# Altium schematic sheet 11 SWITCH & LED.SchDoc
size 513 x 386 mm
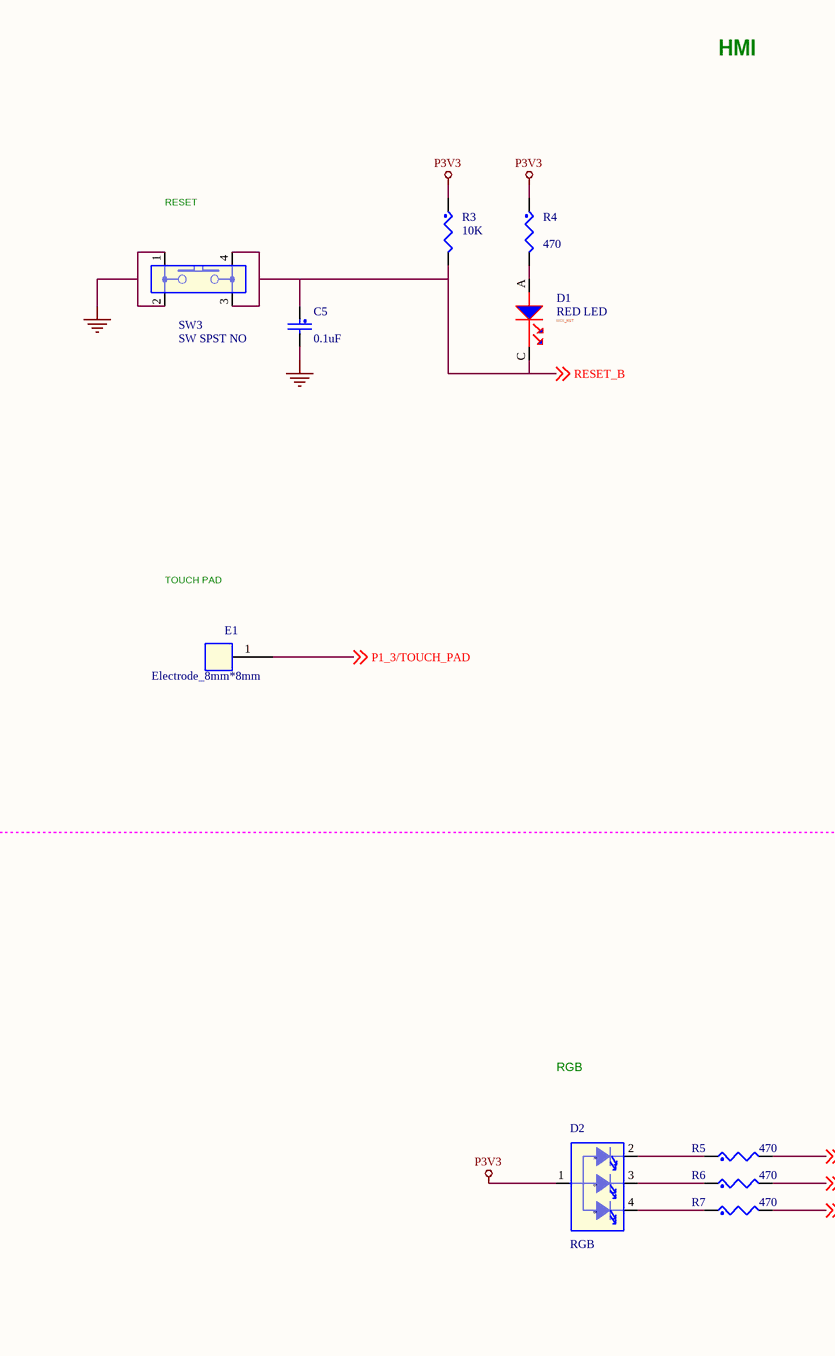
[diagram p0: 11 SWITCH & LED.SchDoc, left]
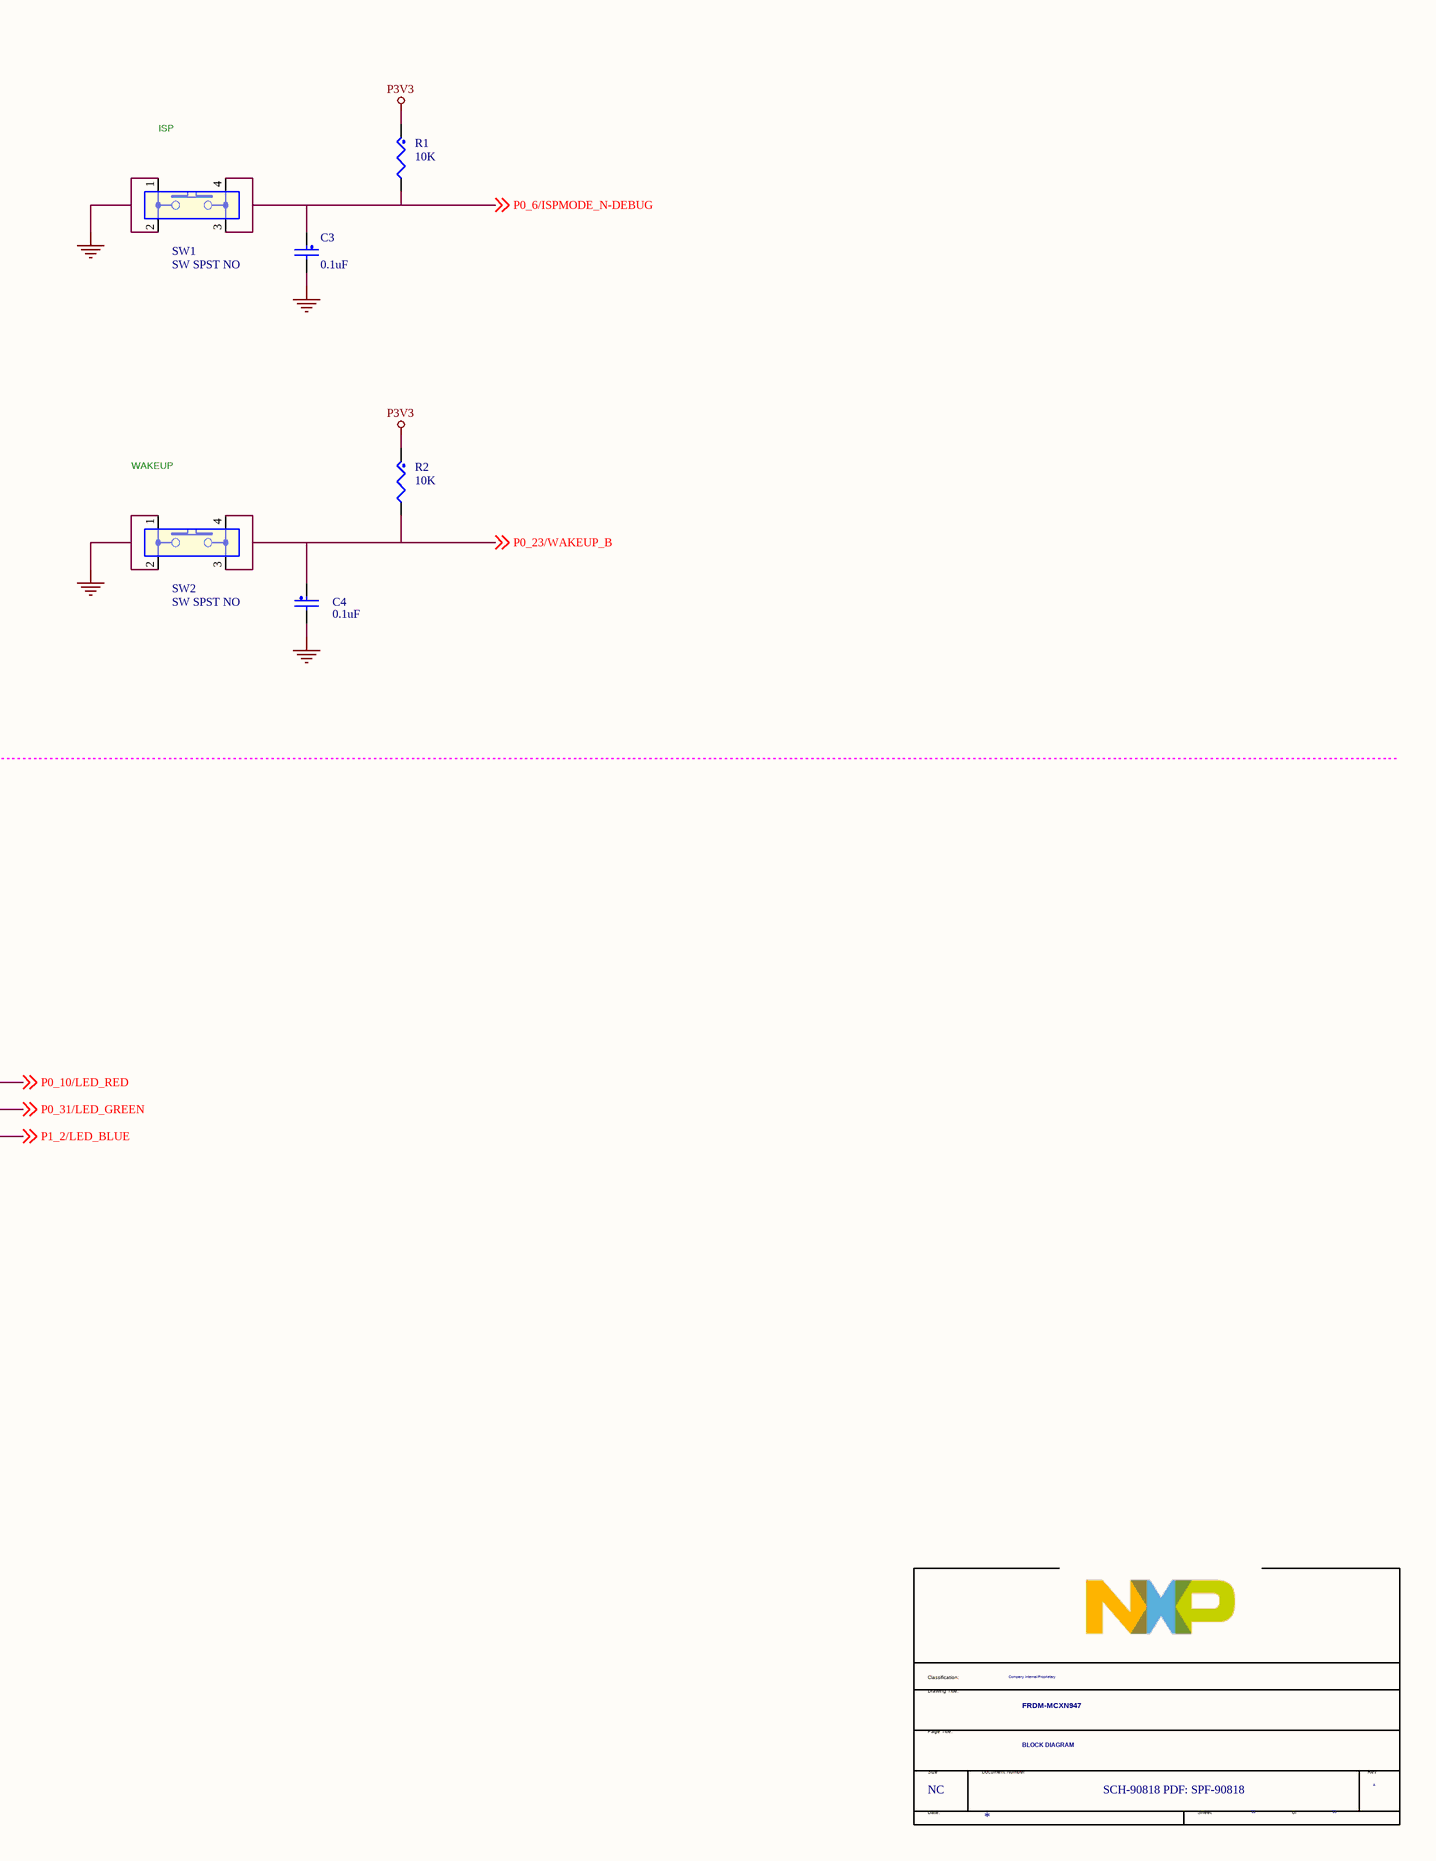
[diagram p1: 11 SWITCH & LED.SchDoc, right]

## Parts
*  Doc: SCH-90818 PDF: SPF-90818  RevCode: A  Title: FRDM-MCXN947  Page Size: NC  Page Number: 11  Page Count: 13  PageTitle: BLOCK DIAGRAM  Classification: Company Internal/Proprietary  (hidden comment: TitleBlock_FS)  (graphical)
C3  0.1uF  [CC0402_25]
C4  0.1uF  [CC0402_25]
C5  0.1uF  [CC0402_25]
D1  RED LED  SILK: MCX_RST  [led_1p1_1p1x0p6_sm]
D2  RGB  [led4_2p7x2p6_sm]
E1  Electrode_8mm*8mm  SILK: TOUCH PAD  [electrode_8mm_sq_cir]
R1  10K  [RC0402_25]
R2  10K  [RC0402_25]
R3  10K  [RC0402_25]
R4  470  [RC0402_25]
R5  470  [RC0402_25]
R6  470  [RC0402_25]
R7  470  [RC0402_25]
SW1  SW SPST NO  SILK: ISP  [sw4_4p15_4p2x3p2_sm]
SW2  SW SPST NO  SILK: WAKEUP  [sw4_4p15_4p2x3p2_sm]
SW3  SW SPST NO  SILK: RESET  [sw4_4p15_4p2x3p2_sm]

## Nets
GND: C3.2 C4.2 C5.2 SW1.1 SW1.2 SW2.1 SW2.2 SW3.1 SW3.2
P3V3: D2.1(ANODE) R1.1 R2.1 R3.1 R4.1
P0_6/ISPMODE_N-DEBUG: C3.1 R1.2 SW1.3 SW1.4 ; off-sheet P0_6/ISPMODE_N-DEBUG
P0_10/LED_RED: R5.2 ; off-sheet P0_10/LED_RED
P0_23/WAKEUP_B: C4.1 R2.2 SW2.3 SW2.4 ; off-sheet P0_23/WAKEUP_B
P0_31/LED_GREEN: R6.2 ; off-sheet P0_31/LED_GREEN
P1_2/LED_BLUE: R7.2 ; off-sheet P1_2/LED_BLUE
P1_3/TOUCH_PAD: E1.1 ; off-sheet P1_3/TOUCH_PAD
RESET_B: C5.1 D1.C(CATHODE) R3.2 SW3.3 SW3.4 ; off-sheet RESET_B
NetD1_A: D1.A(ANODE) R4.2
NetD2_2: D2.2(CATHODE1) R5.1
NetD2_3: D2.3(CATHODE2) R6.1
NetD2_4: D2.4(CATHODE3) R7.1

## Notes on the sheet
- HMI
- (in symbol LRTBR48G_4P) R; G; B
- (in symbol TitleBlock_FS) Classification:; Drawing Title:; Page Title:; Size; Document Number; Rev; Date:; Sheet; of

## Library data of the parts
* = TitleBlock_FS: Classification: Public, Company Internal/Proprietary, Company Confidential,  Company Secret; OrgName: NXP Semiconductors; OrgAddr1: 6501 William Cannon Drive West; OrgAddr2: Austin, TX 78735-8598; Variant Name: <Core Design>; Page Create Date: March  8, 1995; Page Modify Date: *
C3 = CAP_NP: CAP CER 0.1UF 16V 10% X7R 0402; CLASS: DISCRETE; Temp Range: -55C to +125C; SIGNAL_MODEL: DEFAULT_CAPACITOR_100000pF_2_1; AGILE_PN: 150-75182; MFG_NAME01: Samsung Electro-Mechanics; MFG_PN01: CL05B104KO5NNNC; CAD_APPROVED: Yes; FPLIST: CC0402_25,CC0402_HD,0402_CC,CAPC0402_L,cc0402_lamp3; Temp_Range: -55°C to +85°C; PCB Footprint: CC0402_25; 3D_Mechanical_Footprint_File: http://fcl.am.freescale.net/ALLEGRO/step/cc0402_25.STEP; Rated Voltage: 16V; Tolerance: 10%; ROHS: Yes; HEIGHT: 0.635MM; TOL: 10%; VOLTAGE: 16V
C4 = CAP_NP: CAP CER 0.1UF 16V 10% X7R 0402; CLASS: DISCRETE; Temp Range: -55C to +125C; AGILE_PN: 150-75182; MFG_NAME01: Samsung Electro-Mechanics; MFG_PN01: CL05B104KO5NNNC; CAD_APPROVED: Yes; FPLIST: CC0402_25,CC0402_HD,0402_CC,CAPC0402_L,cc0402_lamp3; SIGNAL_MODEL: DEFAULT_CAPACITOR_100000pF_2_1; Temp_Range: -55°C to +85°C; PCB Footprint: CC0402_25; 3D_Mechanical_Footprint_File: http://fcl.am.freescale.net/ALLEGRO/step/cc0402_25.STEP; Rated Voltage: 16V; Tolerance: 10%; ROHS: Yes; HEIGHT: 0.635MM; VOLTAGE: 16V
C5 = CAP_NP: CAP CER 0.1UF 16V 10% X7R 0402; CLASS: DISCRETE; Temp_Range: -55°C to +85°C; FPLIST: CC0402_25,CC0402_HD,0402_CC,CAPC0402_L,cc0402_lamp3; CAD_APPROVED: Yes; MFG_PN01: CL05B104KO5NNNC; MFG_NAME01: Samsung Electro-Mechanics; AGILE_PN: 150-75182; SIGNAL_MODEL: DEFAULT_CAPACITOR_100000pF_2_1; Temp Range: -55C to +125C; PCB Footprint: CC0402_25; VOLTAGE: 16V; TOL: 10%; HEIGHT: 0.635MM; ROHS: Yes; Tolerance: 10%; Rated Voltage: 16V; 3D_Mechanical_Footprint_File: http://fcl.am.freescale.net/ALLEGRO/step/cc0402_25.STEP
D1 = LED: LED RED SGL 30mA 5V 0402; CLASS: IC; MFG_PN01: 150040SS73240; MFG_NAME01: Wurth Electronik GmbH & Co. KG (PCB); Temp Range: -40¡ã C to + 85¡ã C; CAD_APPROVED: YES; AGILE_PN: 370-77428; 3D_Mechanical_Footprint_File: http://fcl.am.freescale.net/ALLEGRO/step/led_1p1_1p1x0p6_sm.STEP; HEIGHT: 0.5 MM; PCB Footprint: led_1p1_1p1x0p6_sm
D2 = LRTBR48G_4P: LED RED/GRN/BL TRI 20/20/20MA SMT; CLASS: IC; AGILE_PN: 370-76899; CAD_APPROVED: YES; Temp Range: -40 to +100; MFG_NAME01: Lianyungang Meihua Electronics Technology Co.,Ltd; MFG_PN01: MHPA2525RGBDT-S; PCB Footprint: led4_2p7x2p6_sm; HEIGHT: 2.14MM; SILK: RGB
E1 = ELECTRODE: CAPACITIVE SINGLE ELECTRODE 8MM SQUARE ROUNDED CORNERS, NO PART TO ORDER; CLASS: IC; MFG_PN01: NO PART TO ORDER1; MFG_NAME01: NA; CAD_APPROVED: Yes; AGILE_PN: 510-78043; ROHS: Yes; HEIGHT: 0.1MM; PCB Footprint: electrode_8mm_sq_cir
R1 R2 = RES: RES MF 10K 1/16W 1% 0402; CLASS: DISCRETE; TOL: 5%; FPLIST: RC0402_25,RC0402_HD,0402_CC,RC0402_X2; CAD_APPROVED: Yes; MFG_PN01: NRCL04F1002TRF; MFG_NAME01: NIC COMPONENTS CORP; AGILE_PN: 470-80452; SIGNAL_MODEL: DEFAULT_RESISTOR_10000OHM_2_1; Temp_Range: –55 °C to +155 °C; HEIGHT: 0.40 MM; ROHS: Yes; Tolerance: 1%; PCB Footprint: RC0402_25
R3 = RES: RES MF 10K 1/16W 1% 0402; CLASS: DISCRETE; SIGNAL_MODEL: DEFAULT_RESISTOR_10000OHM_2_1; AGILE_PN: 470-80452; MFG_NAME01: NIC COMPONENTS CORP; MFG_PN01: NRCL04F1002TRF; CAD_APPROVED: Yes; FPLIST: RC0402_25,RC0402_HD,0402_CC,RC0402_X2; TOL: 5%; Temp_Range: –55 °C to +155 °C; Tolerance: 1%; ROHS: Yes; HEIGHT: 0.40 MM; PCB Footprint: RC0402_25
R4 R5 = RES: RES MF 470 OHM 1/16W 5% 0402; CLASS: DISCRETE; Temp_Range: -55&#8451; to 155&#8451;; SIGNAL_MODEL: DEFAULT_RESISTOR_430.000000OHM_2_1; FPLIST: RC0402_25,RC0402_HD,0402_CC; CAD_APPROVED: Yes; MFG_PN01: ERJ2GEJ471X; MFG_NAME01: PANASONIC; AGILE_PN: 470-30315; TOL: 1%; ROHS: Yes; Tolerance: 5%; HEIGHT: 0.45mm; PCB Footprint: RC0402_25
R6 R7 = RES: RES MF 470 OHM 1/16W 5% 0402; CLASS: DISCRETE; TOL: 1%; AGILE_PN: 470-30315; MFG_NAME01: PANASONIC; MFG_PN01: ERJ2GEJ471X; CAD_APPROVED: Yes; FPLIST: RC0402_25,RC0402_HD,0402_CC; SIGNAL_MODEL: DEFAULT_RESISTOR_430.000000OHM_2_1; Temp_Range: -55&#8451; to 155&#8451;; HEIGHT: 0.45mm; Tolerance: 5%; ROHS: Yes; PCB Footprint: RC0402_25
SW1 = SW_PSHBT_SPST_2: SW SP PB 50mA 16V SMT; CLASS: IC; MFG_PN01: 434123025826; MFG_NAME01: WURTH ELEKTRONIK EISOS GMBH & CO. KG (ELECTRONIC & ELECTROMEHANICAL COMP); Temp Range: -40C to +85C; CAD_APPROVED: Yes; AGILE_PN: 510-78653; 3D_Mechanical_Footprint_File: http://fcl.am.freescale.net/ALLEGRO/step/sw4_4p15_4p2x3p2_sm.STEP; ROHS: Yes; HEIGHT: 2.60 MM; PCB Footprint: sw4_4p15_4p2x3p2_sm
SW2 SW3 = SW_PSHBT_SPST_2: SW SP PB 50mA 16V SMT; CLASS: IC; AGILE_PN: 510-78653; CAD_APPROVED: Yes; Temp Range: -40C to +85C; MFG_NAME01: WURTH ELEKTRONIK EISOS GMBH & CO. KG (ELECTRONIC & ELECTROMEHANICAL COMP); MFG_PN01: 434123025826; HEIGHT: 2.60 MM; ROHS: Yes; 3D_Mechanical_Footprint_File: http://fcl.am.freescale.net/ALLEGRO/step/sw4_4p15_4p2x3p2_sm.STEP; PCB Footprint: sw4_4p15_4p2x3p2_sm